# Altium schematic sheet Schematic.SchDoc: Assignment 2
size A4; DrawnBy: William Belcher; Revision: 1; SheetNumber: 1; SheetTotal: 1
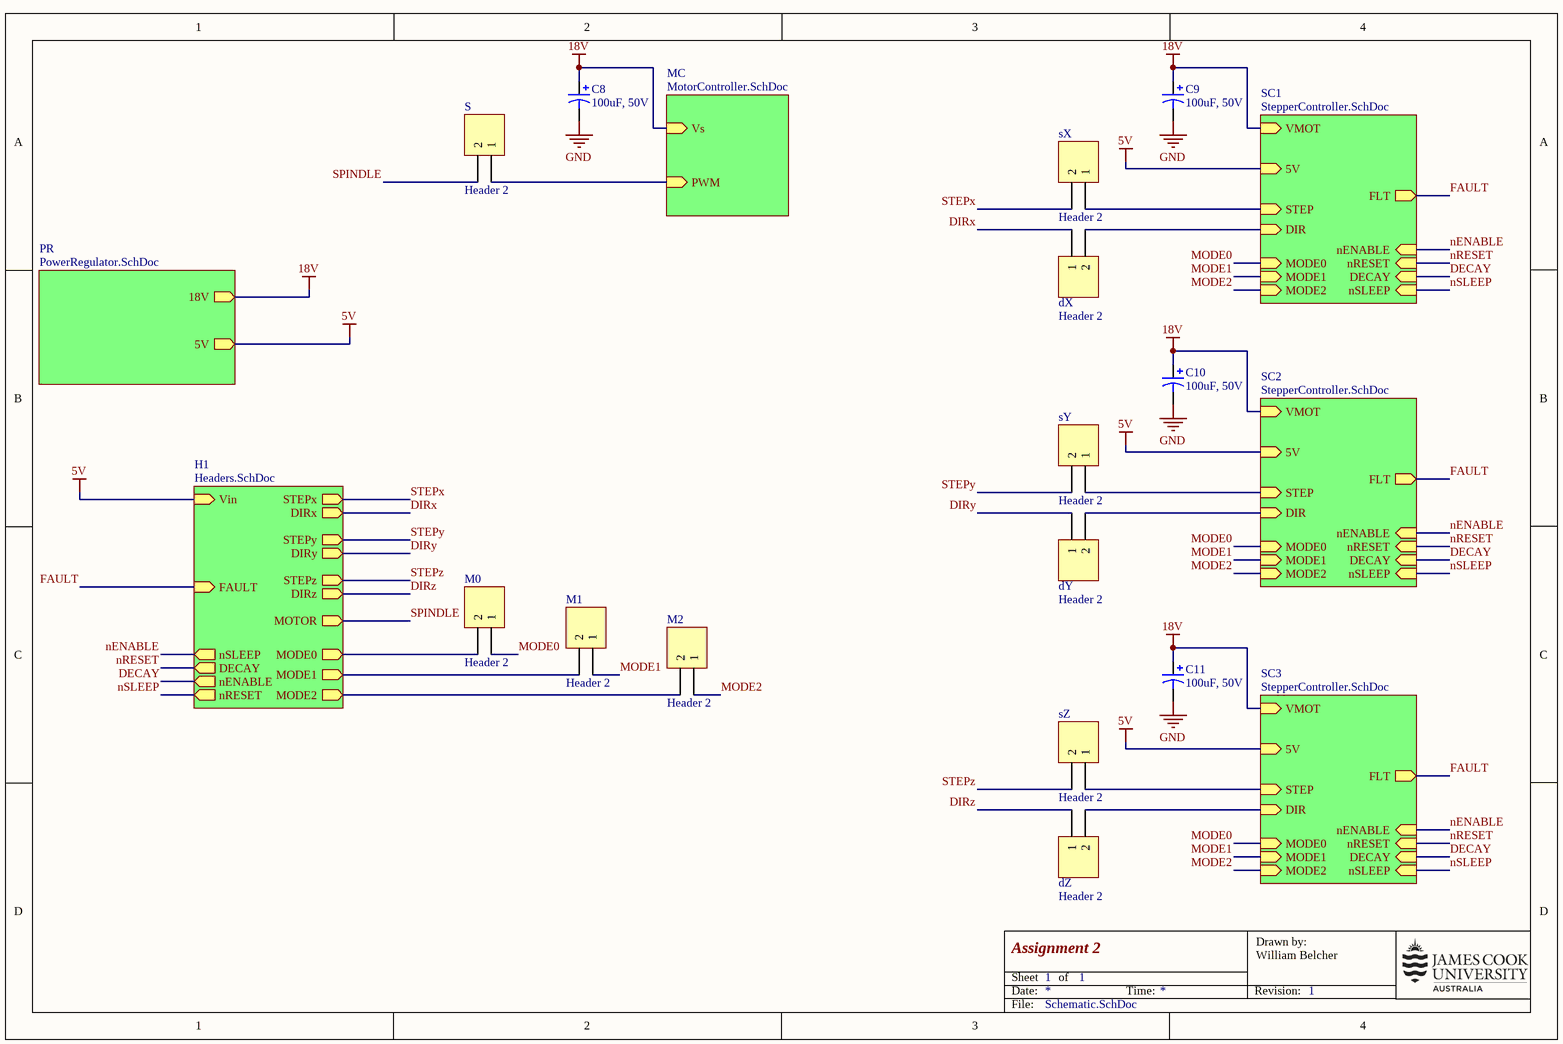
[diagram p0: Schematic.SchDoc]

## Parts
C8  100uF, 50V  [Capacitor radial 8mm]
C9  100uF, 50V  [Capacitor radial 8mm]
C10  100uF, 50V  [Capacitor radial 8mm]
C11  100uF, 50V  [Capacitor radial 8mm]
dX  Header 2  [HDR1X2]
dY  Header 2  [HDR1X2]
dZ  Header 2  [HDR1X2]
M0  Header 2  [HDR1X2]
M1  Header 2  [HDR1X2]
M2  Header 2  [HDR1X2]
S  Header 2  [HDR1X2]
sX  Header 2  [HDR1X2]
sY  Header 2  [HDR1X2]
sZ  Header 2  [HDR1X2]

## Sub-sheets
H1 = Headers.SchDoc: STEPx (out), DIRx (out), DIRy (out), STEPy (out), STEPz (out), DIRz (out), MOTOR (out), MODE1 (out), MODE2 (out), MODE0 (out), FAULT (in), Vin (in), nSLEEP (out), DECAY (out), nENABLE (out), nRESET (out)
MC = MotorController.SchDoc: PWM (in), Vs (in)
PR = PowerRegulator.SchDoc: 18V (out), 5V (out)
SC1 = StepperController.SchDoc: DIR (in), STEP (in), VMOT (in), 5V (in), FLT (out), MODE0 (in), MODE1 (in), MODE2 (in), nENABLE (in), nRESET (in), DECAY (in), nSLEEP (in)
SC2 = StepperController.SchDoc: DIR (in), STEP (in), VMOT (in), 5V (in), FLT (out), MODE0 (in), MODE1 (in), MODE2 (in), nENABLE (in), nRESET (in), DECAY (in), nSLEEP (in)
SC3 = StepperController.SchDoc: DIR (in), STEP (in), VMOT (in), 5V (in), FLT (out), MODE0 (in), MODE1 (in), MODE2 (in), nENABLE (in), nRESET (in), DECAY (in), nSLEEP (in)

## Nets
5V: sheet PR/5V, sheet SC1/5V, sheet H1/Vin, sheet SC2/5V, sheet SC3/5V
18V: C8.1 C9.1 C10.1 C11.1 ; sheet PR/18V, sheet SC1/VMOT, sheet MC/Vs, sheet SC2/VMOT, sheet SC3/VMOT
GND: C8.2 C9.2 C10.2 C11.2
DECAY: sheet SC1/DECAY, sheet H1/nENABLE, sheet SC2/DECAY, sheet SC3/DECAY
DIRx: dX.1 ; sheet H1/DIRx
DIRy: dY.1 ; sheet H1/DIRy
DIRz: dZ.1 ; sheet H1/DIRz
FAULT: sheet SC1/FLT, sheet H1/FAULT, sheet SC2/FLT, sheet SC3/FLT
MODE0: M0.1 ; sheet SC1/MODE0, sheet SC2/MODE0, sheet SC3/MODE0
MODE1: M1.1 ; sheet SC1/MODE1, sheet SC2/MODE1, sheet SC3/MODE1
MODE2: M2.1 ; sheet SC1/MODE2, sheet SC2/MODE2, sheet SC3/MODE2
nENABLE: sheet SC1/nENABLE, sheet H1/nSLEEP, sheet SC2/nENABLE, sheet SC3/nENABLE
nRESET: sheet SC1/nRESET, sheet H1/DECAY, sheet SC2/nRESET, sheet SC3/nRESET
nSLEEP: sheet SC1/nSLEEP, sheet H1/nRESET, sheet SC2/nSLEEP, sheet SC3/nSLEEP
SPINDLE: S.2 ; sheet H1/MOTOR
STEPx: sX.2 ; sheet H1/STEPx
STEPy: sY.2 ; sheet H1/STEPy
STEPz: sZ.2 ; sheet H1/STEPz
NetdX_2: dX.2 ; sheet SC1/DIR
NetdY_2: dY.2 ; sheet SC2/DIR
NetdZ_2: dZ.2 ; sheet SC3/DIR
NetM0_2: M0.2 ; sheet H1/MODE0
NetM1_2: M1.2 ; sheet H1/MODE1
NetM2_2: M2.2 ; sheet H1/MODE2
NetS_1: S.1 ; sheet MC/PWM
NetsX_1: sX.1 ; sheet SC1/STEP
NetsY_1: sY.1 ; sheet SC2/STEP
NetsZ_1: sZ.1 ; sheet SC3/STEP

## Notes on the sheet
- Date:
- Sheet
- of
- Time:
- Revision:
- Drawn by:
- File:

## Library data of the parts
C8-C11 = Cap 100uF, 50V, THT radial: Electrolytic Capacitor, 100 µF, 50 V, ± 20%, Radial Leaded, 8 mm
dX dY dZ M0-M2 S sX sY sZ = Header 2: Header, 2-Pin; LatestRevisionDate: 17-Jul-2002; LatestRevisionNote: Re-released for DXP Platform.; Publisher: Altium Limited